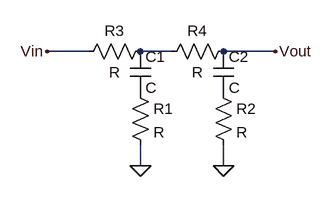
[diagram p0: schematic Draft3.asc]
Draft3.asc, the LTspice schematic file:
Version 4
SHEET 1 880 680
WIRE 64 80 0 80
WIRE 192 80 144 80
WIRE 352 80 272 80
WIRE 144 256 144 224
WIRE 272 256 272 224
FLAG 144 256 0
FLAG 272 256 0
FLAG 0 80 Vin
FLAG 352 80 Vout
SYMBOL res 128 128 R0
SYMATTR InstName R1
SYMBOL res 256 128 R0
SYMATTR InstName R2
SYMBOL cap 128 80 R0
SYMATTR InstName C1
SYMBOL cap 256 80 R0
SYMATTR InstName C2
SYMBOL res 160 64 R90
WINDOW 0 0 56 VBottom 2
WINDOW 3 32 56 VTop 2
SYMATTR InstName R3
SYMBOL res 288 64 R90
WINDOW 0 0 56 VBottom 2
WINDOW 3 32 56 VTop 2
SYMATTR InstName R4

The netlist it stands for:
* Draft3.asc
R1 P001 0 R
R2 P002 0 R
C1 N001 P001 C
C2 Vout P002 C
R3 N001 Vin R
R4 Vout N001 R
.backanno
.end